# EAGLE design radio (EAGLE 6.4)
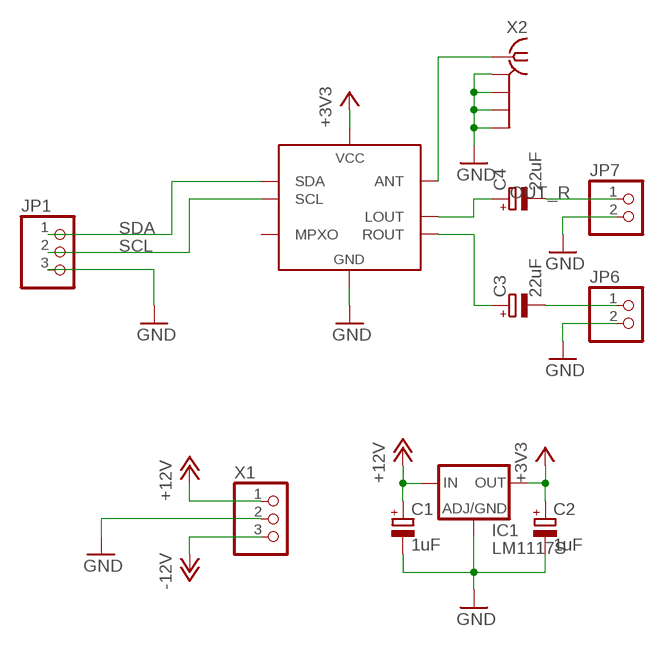
[diagram p0: schematic, sheet 1]

## Parts
C1  1uF  CPOL-EUSMD  [SMC_A]
C2  1uF  CPOL-EUSMD  [SMC_A]
C3  22uF  CPOL-EUD  [PANASONIC_D]
C4  22uF  CPOL-EUD  [PANASONIC_D]
IC1  LM1117S  [SOT223]
JP1  PINHD-1X3180  [1X03]
JP6  PINHD-1X2  [1X02]
JP7  PINHD-1X2  [1X02]
U1  TEA5767  [TEA5767]
X1  22-23-2031  [22-23-2031]
X2  BU-SMA-V  [BU-SMA-V]

## Nets
+3V3: C2.+ IC1.2(OUT) IC1.4(OUT) U1.5(VCC)
+12V: C1.+ IC1.3(IN) X1.1
-12V: X1.3
GND: C1.- C2.- IC1.1(ADJ) JP1.3 JP6.2 JP7.2 U1.3(GND) U1.6(GND) X1.2 X2.2(GND1) X2.3(GND2) X2.4(GND3) X2.5(GND4)
N$1: U1.10(ANT) X2.1
N$2: C3.+ U1.7(ROUT)
N$3: C3.- JP6.1
N$4: C4.- JP7.1
OUT_R: C4.+ U1.8(LOUT)
SCL: JP1.2 U1.2(SCL)
SDA: JP1.1 U1.1(SDA)
Unconnected: U1.9(MPXO)

## Library data of the parts
C1-C4 = amp:CPOL-EU: POLARIZED CAPACITOR, European symbol
IC1 = amp:LM1117: Low drop fixed and adjustable positive voltage regulators 1 A Source: http://www.st.com/stonline/products/literature/ds/7194/ld1117axx.pdf
JP1 = amp:PINHD-1X3: PIN HEADER
JP6 JP7 = amp:PINHD-1X2: PIN HEADER
U1 = amp:TEA5767
X1 = amp:22-23-2031: .100" (2.54mm) Center Header - 3 Pin
X2 = amp:BU-SMA-V: FEMALE SMA CONNECTOR Radiall distributor RS 112-3794; OC_FARNELL: unknown; OC_NEWARK: unknown

## Board
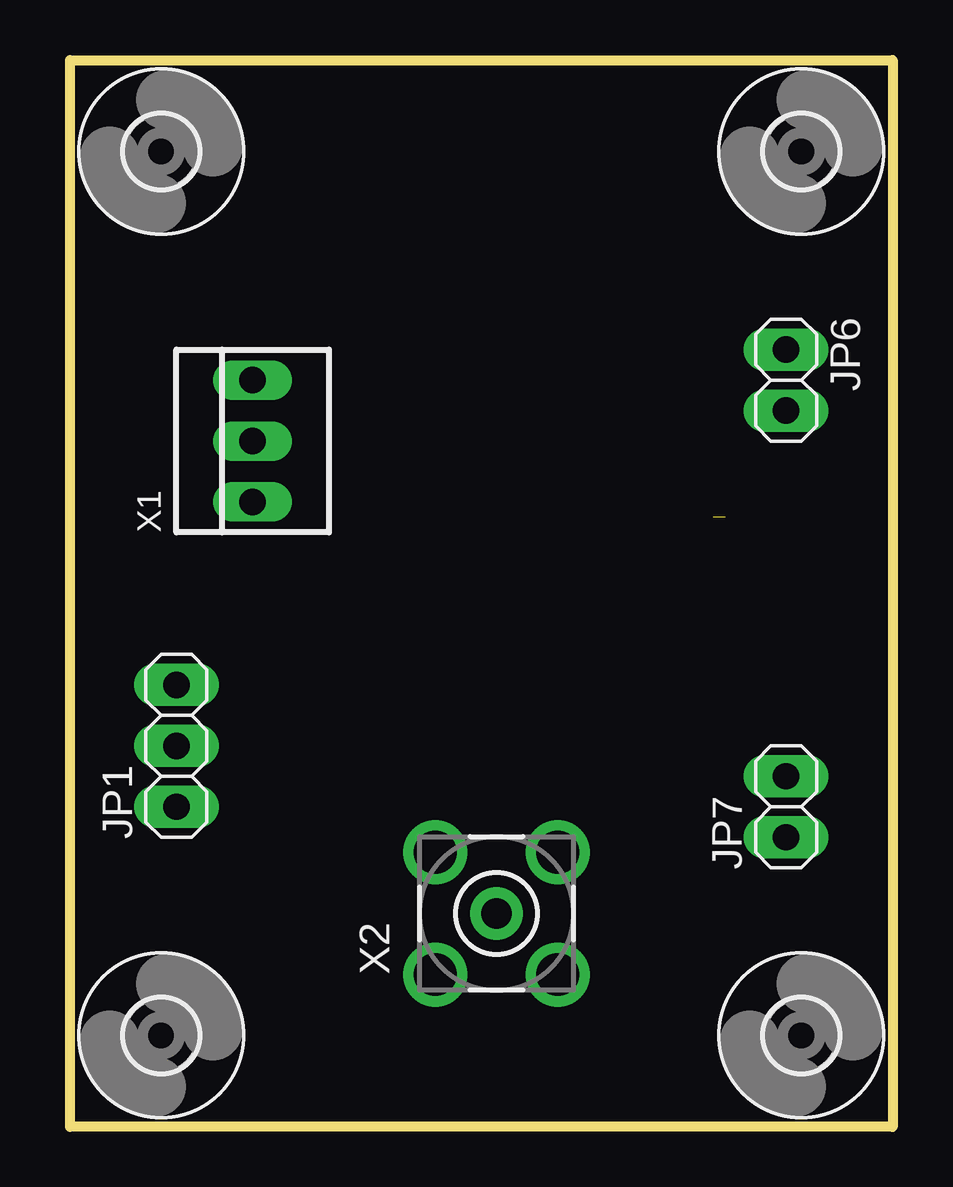
[diagram p1: board, top side]
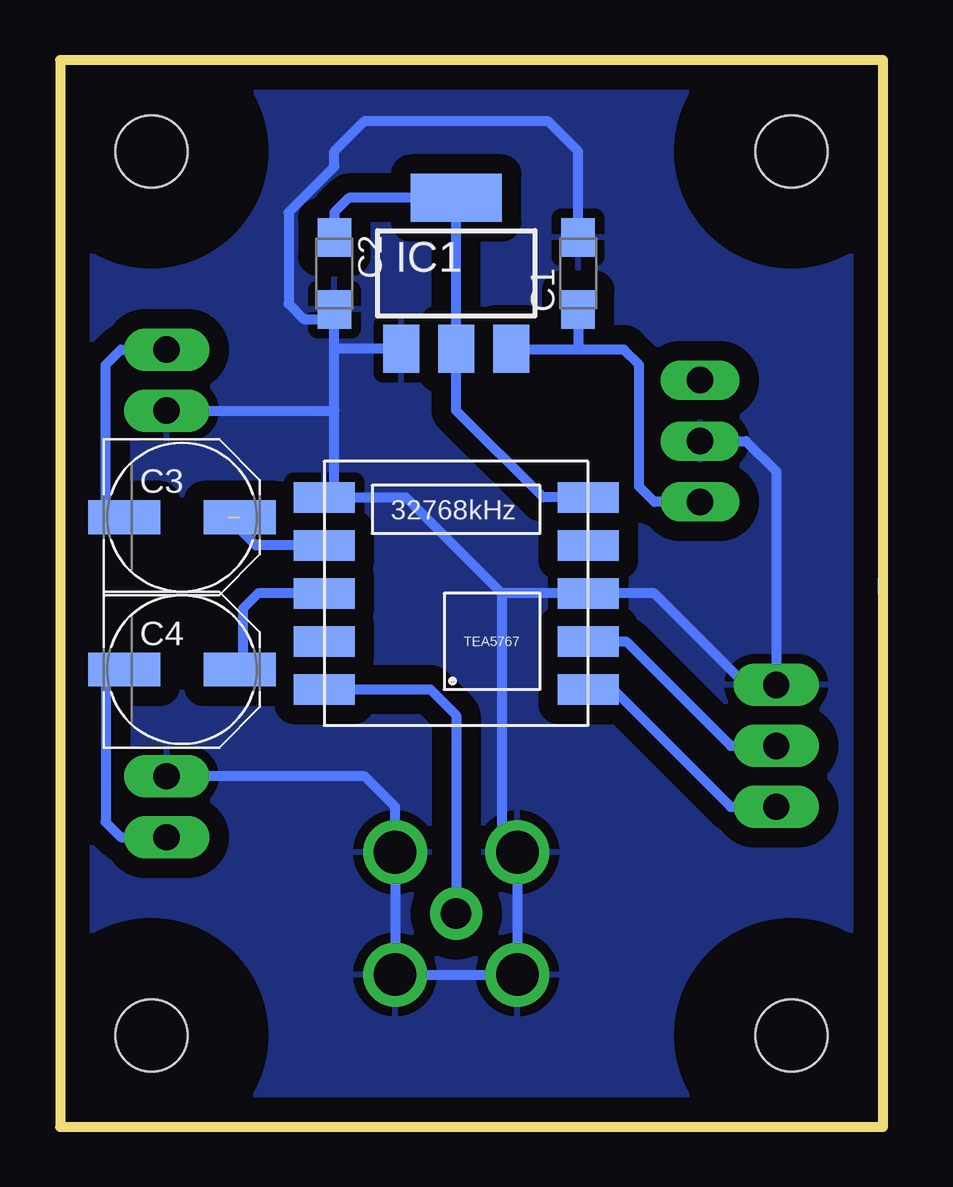
[diagram p2: board, bottom side, seen from below]

Size 34.29 x 44.45 mm. Coordinates in mm from the lower left corner, seen from the top.
Outline: 0.64,44.44 0,44.45
Outline: 0,44.45 0,0 34.29,0 34.29,44.45 0,44.45
Copper layers (1*16): Top 0.035mm / dielectric 1.5mm / Bottom 0.035mm
Design rules: minimum track width 10mil, minimum drill 24mil, track to track 8mil, track to pad 8mil, pad to pad 8mil, via to via 8mil, smd to smd 8mil, copper to edge 40mil, drill to drill 8mil, minimum pad ring 10mil, minimum via ring 8mil, stop-mask expansion 4mil, vias tented up to drill 0mil, thermal gap 16mil

### Footprints (pad centres in the part's own frame; a part is rotated, then mirrored left to right if it is on the bottom)
SMC_A = smd 1.6 x 1.4: + -1.5,0; - 1.5,0
PANASONIC_D = smd 3 x 1.4: + 2.4,0; - -2.4,0
SOT223 = smd 1.5 x 2: 1 -2.3,-3.15; 2 0,-3.15; 3 2.3,-3.15 | smd 3.8 x 2: 4 0,3.15
1X03 = drill 1.1 pad 1.778 long: 1 -2.54,0; 2 0,0; 3 2.54,0
1X02 = drill 1.1 pad 1.778 long: 1 -1.27,0; 2 1.27,0
TEA5767 = smd 2.54 x 1.27: 1 -5.5,4; 2 -5.5,2; 3 -5.5,0; 4 -5.5,-2; 5 -5.5,-4; 6 5.5,-4; 7 5.5,-2; 8 5.5,0; 9 5.5,2; 10 5.5,4
3,0 = hole 3: 0,0
22-23-2031 = drill 1.1 long: 1 -2.54,0; 2 0,0; 3 2.54,0
BU-SMA-V = drill 1.27 pad 2.184: 1 0,0 | drill 1.778: 2 -2.55,2.55; 3 2.55,2.55; 4 2.55,-2.55; 5 -2.55,-2.55

### Placement (x,y rotation side)
C1  10uF  [SMC_A]  12.7,35.56 90 bottom
C2  10uF  [SMC_A]  22.86,35.56 270 bottom
C3  [PANASONIC_D]  29.21,25.4 0 bottom
C4  [PANASONIC_D]  29.21,19.05 0 bottom
IC1  17.78,35.56 0 bottom
JP1  4.45,15.88 90 top
JP6  29.84,31.11 270 top
JP7  29.84,13.34 90 top
U1  17.78,22.23 180 bottom
U$1  [3,0]  3.81,3.81 0 top
U$2  [3,0]  3.81,40.64 0 top
U$3  [3,0]  30.48,40.64 0 top
U$4  [3,0]  30.48,3.81 0 top
X1  7.62,28.57 90 top
X2  17.78,8.89 90 top

### Tracks (layer width: path | path; a pad name or v marks a point on that pad's centre or on a via)
+3V3
  Bottom 0.406: C2.+ 22.86,38.1 22.25,38.71 IC1.4 IC1.2 17.78,29.84 14.16,26.23 U1.5
+12V
  Bottom 0.406: C1.+ 12.7,32.38 | 12.7,32.38 15.46,32.38 IC1.3 | X1.1 9.53,26.04 10.16,26.67 10.16,31.75 10.79,32.38 12.7,32.38
GND
  Bottom 0.406: 15.88,22.23 U1.3 9.53,22.23 5.71,18.41 JP1.3 4.45,27.3 5.71,28.57 X1.2 | 15.88,22.23 19.88,26.23 U1.6 23.28,26.25 22.86,26.67 22.86,29.84 | C1.- 12.7,40.64 13.97,41.91 21.59,41.91 22.86,40.64 22.86,40.01 24.77,38.1 24.77,34.29 24.13,33.66 23.27,33.66 C2.- 22.86,32.38 | 22.86,29.84 22.86,32.38 | IC1.1 22.84,32.41 22.86,32.38 | 15.88,22.23 15.88,12.06 X2.3 X2.2 X2.5 X2.4 20.33,13.35 21.59,14.61 JP7.2 | JP6.2 22.86,29.84
  pour Bottom (isolate 0.813): -1.27,45.72 -1.27,-1.27 35.56,-1.27 35.56,45.72
N$1
  Bottom 0.406: U1.10 18.86,18.23 17.78,17.14 X2.1
N$2  (1 unrouted)
  Bottom 0.406: U1.7 26.13,24.23 27.3,25.4
N$3
  Bottom 0.406: C3.- 32.38,25.4 32.38,31.75 31.75,32.38 JP6.1
N$4
  Bottom 0.406: C4.- 31.75,19.05 32.38,18.41 32.38,12.7 31.75,12.06 JP7.1
N$35
  Bottom 0.406: 0,22.23 0,22.86
OUT_R
  Bottom 0.406: U1.8 26.04,22.23 26.67,21.59 26.67,19.19 C4.+
SCL
  Bottom 0.406: U1.2 10.7,20.23 6.35,15.88 JP1.2
SDA
  Bottom 0.406: U1.1 11.24,18.23 6.35,13.34 JP1.1